# EAGLE schematic codelock (EAGLE 6.5.0)
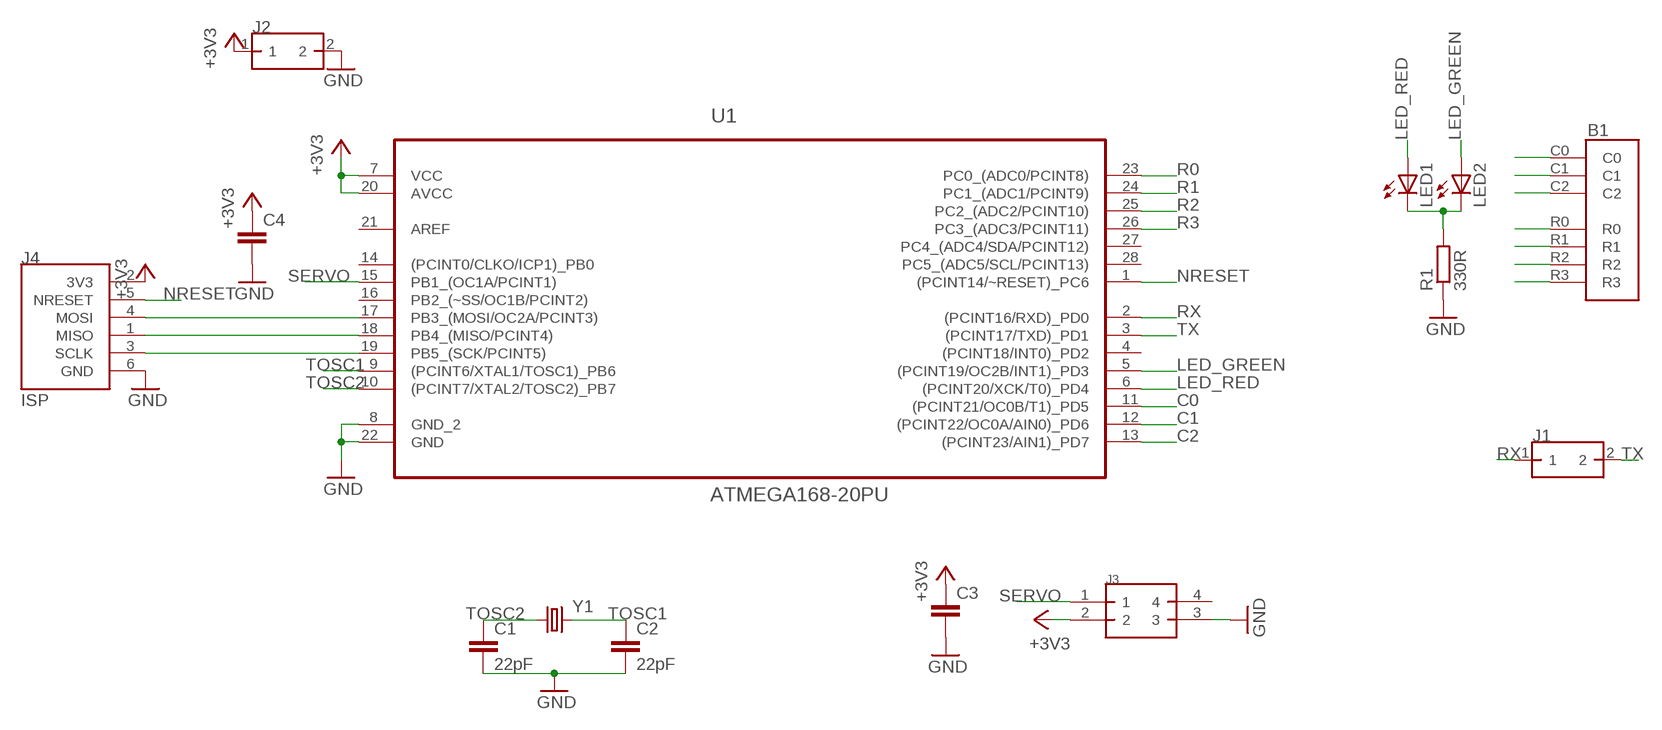
[diagram p0: schematic, sheet 1]

## Parts
B1  KEYPAD12  [KEYPAD12]
C1  22pF  C-EU025-024X044  [C025-024X044]
C2  22pF  C-EU025-024X044  [C025-024X044]
C3  C-EU025-024X044  [C025-024X044]
C4  C-EU025-024X044  [C025-024X044]
J1  1BY2THROUGHHOLE  [1BY2]
J2  1BY2THROUGHHOLE  [1BY2]
J3  4PIN2.54MM1X4TH  [2.54MM1X4TH]
J4  ISP  [DUALHEAD_TH_6]
LED1  LED3MM  [LED3MM]
LED2  LED3MM  [LED3MM]
R1  330R  R12MM  [V234/12]
U1  ATMEGA168-20PU  [DIP254P762X457-28]
Y1  CRYSTALHC49US  [HC49US]

## Nets
+3V3: C3.1 C4.1 J2.1 J3.2 J4.2(3V3) U1.7(VCC) U1.20(AVCC)
C0: B1.C0 U1.11((PCINT21/OC0B/T1)_PD5)
C1: B1.C1 U1.12((PCINT22/OC0A/AIN0)_PD6)
C2: B1.C2 U1.13((PCINT23/AIN1)_PD7)
GND: C1.2 C2.2 C3.2 C4.2 J2.2 J3.3 J4.6(GND) R1.1 U1.8(GND_2) U1.22(GND)
LED_GREEN: LED2.A U1.5((PCINT19/OC2B/INT1)_PD3)
LED_RED: LED1.A U1.6((PCINT20/XCK/T0)_PD4)
N$1: LED1.K(C) LED2.K(C) R1.2
N$2: J4.4(MOSI) U1.17(PB3_(MOSI/OC2A/PCINT3))
N$3: J4.1(MISO) U1.18(PB4_(MISO/PCINT4))
N$4: J4.3(SCLK) U1.19(PB5_(SCK/PCINT5))
NRESET: J4.5(NRESET) U1.1((PCINT14/~RESET)_PC6)
R0: B1.R0 U1.23(PC0_(ADC0/PCINT8))
R1: B1.R1 U1.24(PC1_(ADC1/PCINT9))
R2: B1.R2 U1.25(PC2_(ADC2/PCINT10))
R3: B1.R3 U1.26(PC3_(ADC3/PCINT11))
RX: J1.1 U1.2((PCINT16/RXD)_PD0)
SERVO: J3.1 U1.15(PB1_(OC1A/PCINT1))
TOSC1: C2.1 U1.9((PCINT6/XTAL1/TOSC1)_PB6) Y1.2
TOSC2: C1.1 U1.10((PCINT7/XTAL2/TOSC2)_PB7) Y1.1
TX: J1.2 U1.3((PCINT17/TXD)_PD1)
Unconnected: J3.4 U1.4((PCINT18/INT0)_PD2) U1.14((PCINT0/CLKO/ICP1)_PB0) U1.16(PB2_(~SS/OC1B/PCINT2)) U1.21(AREF) U1.27(PC4_(ADC4/SDA/PCINT12)) U1.28(PC5_(ADC5/SCL/PCINT13))

## Library data of the parts
B1 = Misc:KEYPAD12
C1-C4 = passives:C-EU: CAPACITOR, European symbol
J1 J2 = Headers:1BY2: 2 pads seperated by 0.1" for small connector block
J3 = Headers:4PIN
J4 = Headers:ISP
LED1 LED2 = Semiconductors:LED: LEDs Standard schematic elements and footprints for 5mm, 3mm, 1206, and 0603 sized LEDs. 5mm - Spark Fun Electronics SKU : COM-00529 (and others)
R1 = passives:R
U1 = Atmel_By_element14_Batch_1:ATMEGA168-20PU: Microcontroller; DESCRIPTION: Microcontroller; MPN: ATMEGA168-20PU; OC_FARNELL: 9171207; OC_NEWARK: 01M6892; PACKAGE: PCDIP-28; SUPPLIER: ATMEL
Y1 = SparkFun:CRYSTAL: Crystals Various standard crystals. Proven footprints. Spark Fun Electronics SKU : COM-00534